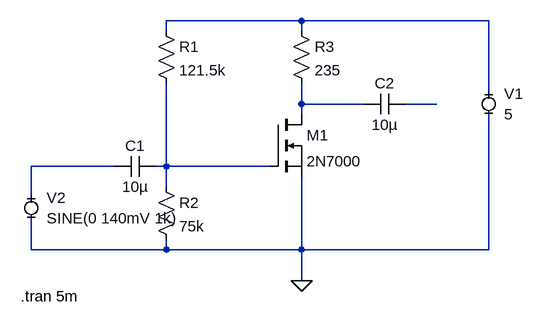
[diagram p0: schematic amplifier.asc]
amplifier.asc, the LTspice schematic file:
Version 4
SHEET 1 880 680
WIRE 192 -96 -16 -96
WIRE 480 -96 192 -96
WIRE -16 -80 -16 -96
WIRE 192 -80 192 -96
WIRE 480 16 480 -96
WIRE 192 32 192 0
WIRE 288 32 192 32
WIRE 400 32 352 32
WIRE 192 48 192 32
WIRE -96 128 -224 128
WIRE -16 128 -16 0
WIRE -16 128 -32 128
WIRE 144 128 -16 128
WIRE -16 160 -16 128
WIRE -224 176 -224 128
WIRE -224 256 -224 208
WIRE -16 256 -16 240
WIRE -16 256 -224 256
WIRE 192 256 192 144
WIRE 192 256 -16 256
WIRE 480 256 480 48
WIRE 480 256 192 256
WIRE 192 304 192 256
FLAG 192 304 0
SYMBOL nmos 144 48 R0
SYMATTR InstName M1
SYMATTR Value 2N7000
SYMBOL MiniSyms4\\voltage- 480 32 R0
WINDOW 123 0 0 Left 2
WINDOW 39 0 0 Left 2
SYMATTR InstName V1
SYMATTR Value 5
SYMBOL MiniSyms4\\voltage- -224 192 R0
WINDOW 123 0 0 Left 2
WINDOW 39 11 39 Left 2
SYMATTR InstName V2
SYMATTR Value SINE(0 140mV 1k)
SYMBOL cap -32 112 R90
WINDOW 0 0 32 VBottom 2
WINDOW 3 32 32 VTop 2
SYMATTR InstName C1
SYMATTR Value 10µ
SYMBOL cap 352 16 R90
WINDOW 0 0 32 VBottom 2
WINDOW 3 32 32 VTop 2
SYMATTR InstName C2
SYMATTR Value 10µ
SYMBOL res -32 -96 R0
SYMATTR InstName R1
SYMATTR Value 121.5k
SYMBOL res -32 144 R0
SYMATTR InstName R2
SYMATTR Value 75k
SYMBOL res 176 -96 R0
SYMATTR InstName R3
SYMATTR Value 235
TEXT -240 328 Left 2 !.tran 5m

The netlist it stands for:
* amplifier.asc
M1 N002 N005 0 0 2N7000
V1 N001 0 5
V2 N004 0 SINE(0 140mV 1k)
C1 N005 N004 10µ
C2 N003 N002 10µ
R1 N001 N005 121.5k
R2 N005 0 75k
R3 N001 N002 235
.model NMOS NMOS
.model PMOS PMOS
.lib standard.mos
.tran 5m
.backanno
.end